# Altium schematic sheet Microcontroleur.SchDoc
size A3; PageSetup: Record=PageOptions|CenterHorizontal=True|CenterVertical=True|PrintScale=0.24|XCorrection=1.00|YCorrection=1.00|PrintKind=0|BorderSize=5000000|LeftOffset=0|BottomOffset=0|Orientation=2|PaperLength=1000|PaperWidth=1000|Scale=100|PaperSource=7|PrintQuality=-4|MediaType=1|DitherType=10|PaperKind=A4|PrintScaleMode=1; Organization: Altium Limited; Address1: Laboratoire de Systèmes Embarqués; Address2: 7, rue de la Serre; Address3: 2610 Saint-Imier / Switzerland
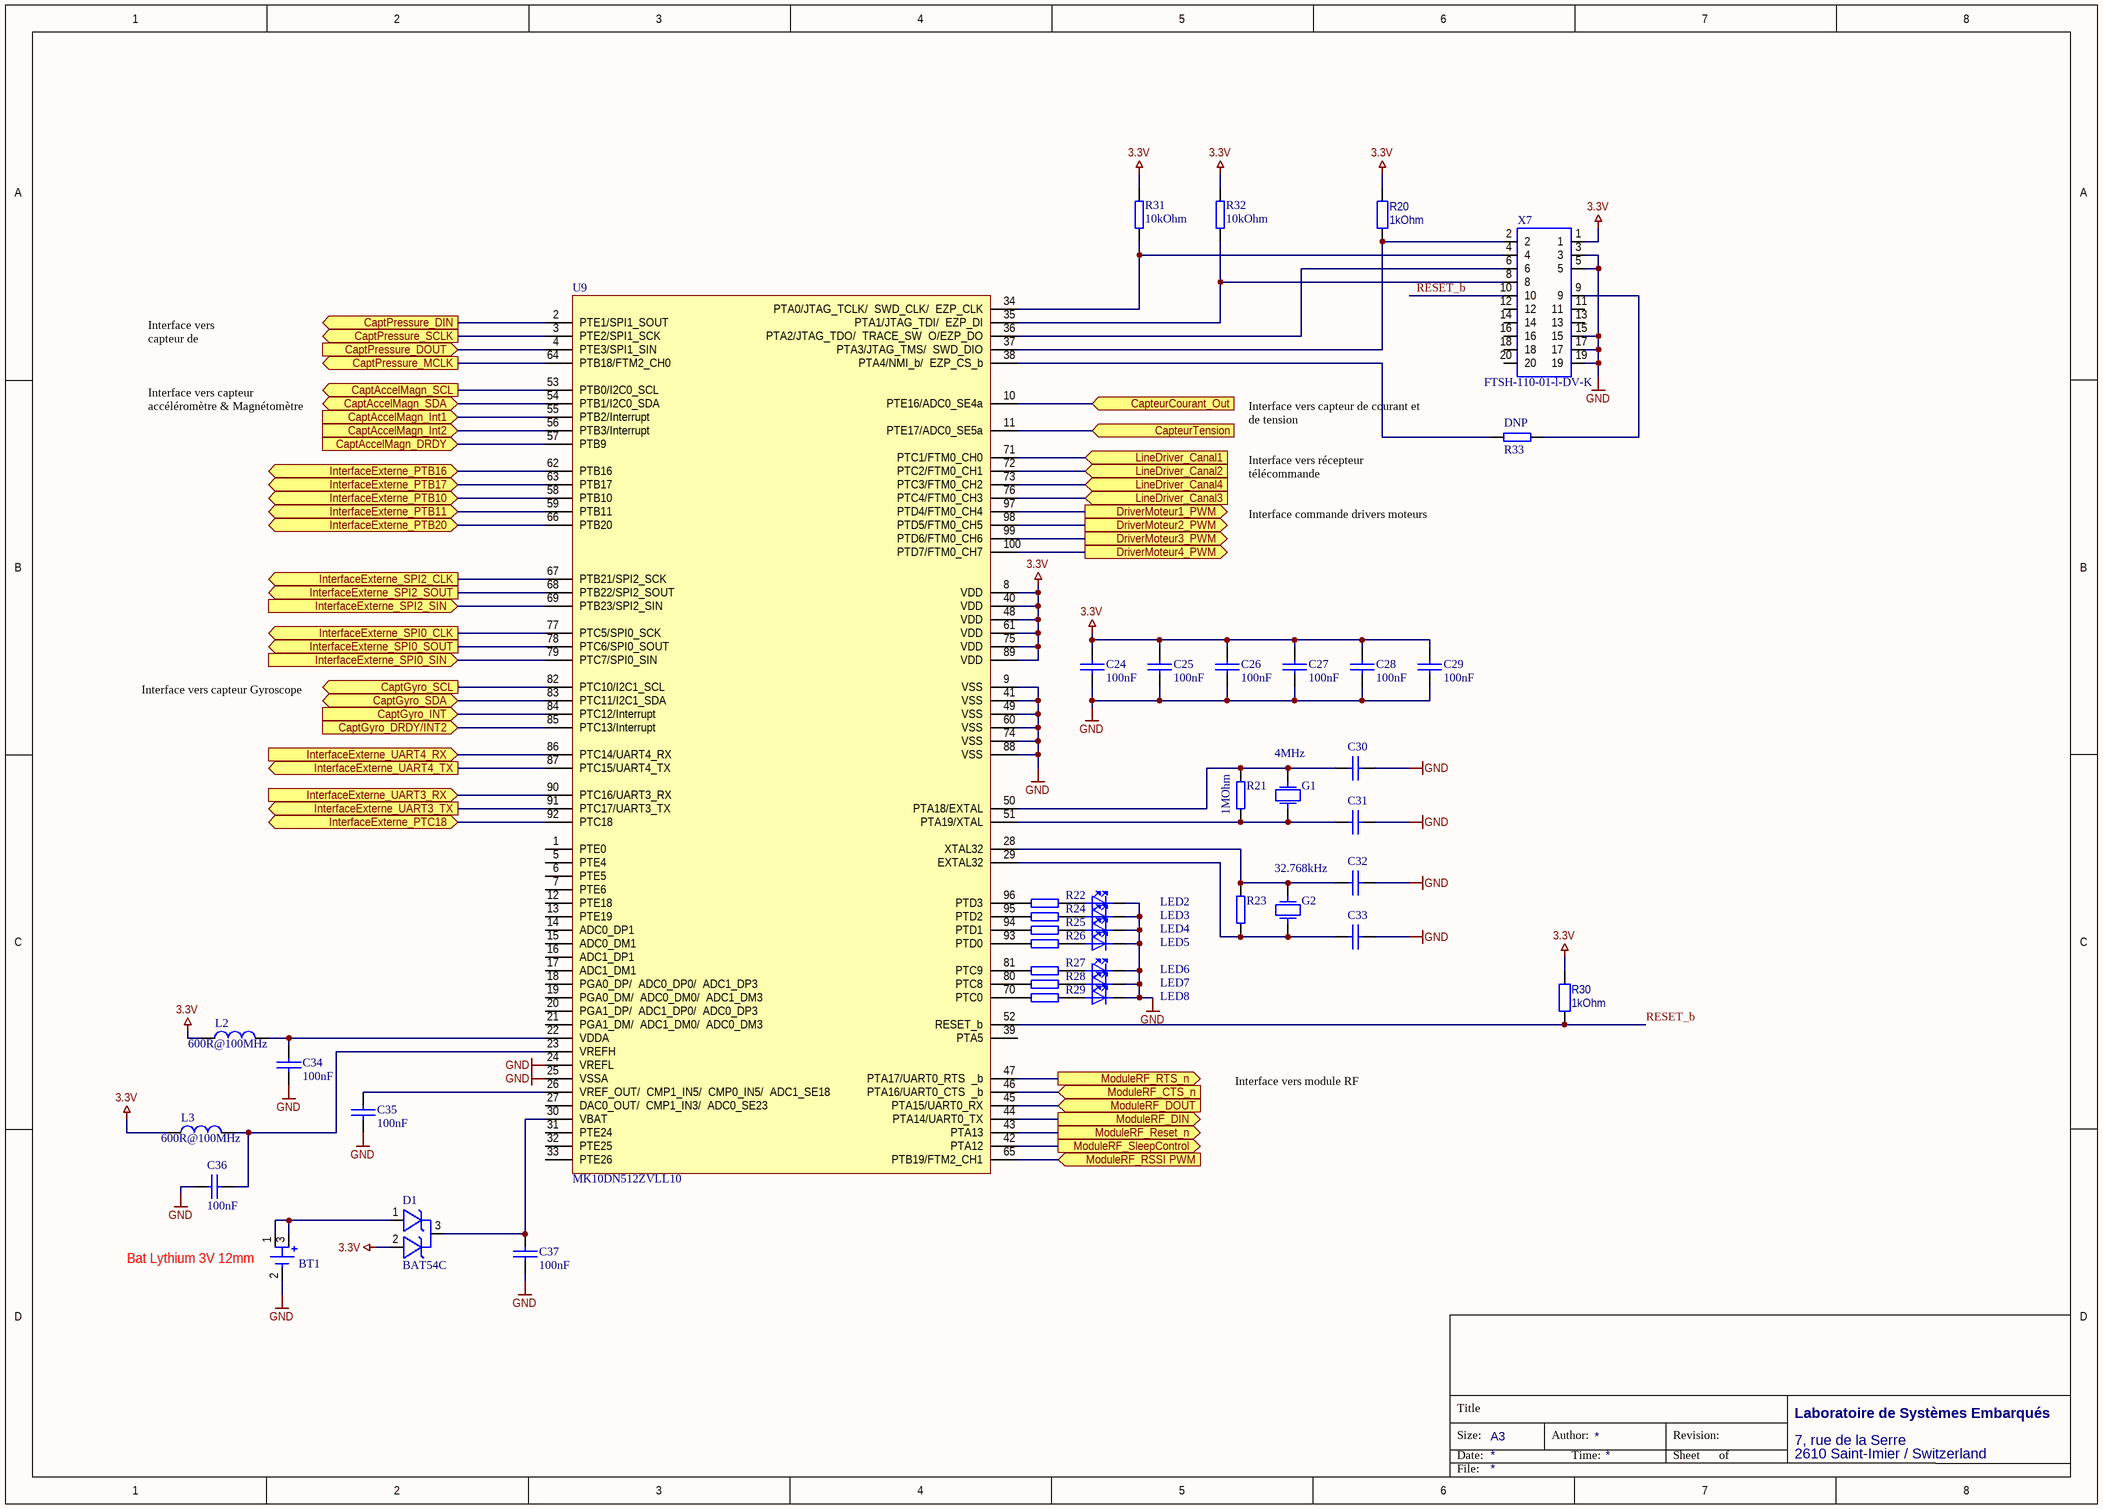
[diagram p0: Microcontroleur.SchDoc]

## Parts
BT1  3000TR  [3000TR]  (value not drawn)
C24  value 100nF  [060301]  (hidden comment: GRM188R71E104KA01D)
C25  value 100nF  [060301]  (hidden comment: GRM188R71E104KA01D)
C26  value 100nF  [060301]  (hidden comment: GRM188R71E104KA01D)
C27  value 100nF  [060301]  (hidden comment: GRM188R71E104KA01D)
C28  value 100nF  [060301]  (hidden comment: GRM188R71E104KA01D)
C29  value 100nF  [060301]  (hidden comment: GRM188R71E104KA01D)
C30  GQM2195C1H200JB01D  [060301]  (value not drawn)
C31  GQM2195C1H200JB01D  [080501]  (value not drawn)
C32  GRM21A5C2E120JW01D  [080501]  (value not drawn)
C33  GRM21A5C2E120JW01D  [080501]  (value not drawn)
C34  value 100nF  [060301]  (hidden comment: GRM188R71E104KA01D)
C35  value 100nF  [060301]  (hidden comment: GRM188R71E104KA01D)
C36  value 100nF  [060301]  (hidden comment: GRM188R71E104KA01D)
C37  value 100nF  [060301]  (hidden comment: GRM188R71E104KA01D)
D1  BAT54C  [SOT2301]
G1  value 4MHz  [Crystal]  (hidden comment: ECS-40-20-5PX-TR)
G2  value 32.768kHz  [Crystal2]  (hidden comment: ECS-.327-12.5-38)
L2  value 600R@100MHz  [080501]  (hidden comment: BLM21AG601SN1D)
L3  value 600R@100MHz  [080501]  (hidden comment: BLM21AG601SN1D)
LED2  LG L29K-G2J1-24-Z  [060301_led]  (value not drawn)
LED3  LG L29K-G2J1-24-Z  [060301_led]  (value not drawn)
LED4  LG L29K-G2J1-24-Z  [060301_led]  (value not drawn)
LED5  LG L29K-G2J1-24-Z  [060301_led]  (value not drawn)
LED6  LG L29K-G2J1-24-Z  [060301_led]  (value not drawn)
LED7  LG L29K-G2J1-24-Z  [060301_led]  (value not drawn)
LED8  LG L29K-G2J1-24-Z  [060301_led]  (value not drawn)
R20  value 1kOhm  [060301]  (hidden comment: RC0603FR-071KL)
R21  value 1MOhm  [080501]  (hidden comment: RMCF0805JT820R)
R22  RMCF0805JT820R  [080501]  (value not drawn)
R23  ERJ-6GEYJ103V  [080501]  (value not drawn)
R24  RMCF0805JT820R  [080501]  (value not drawn)
R25  RMCF0805JT820R  [080501]  (value not drawn)
R26  RMCF0805JT820R  [080501]  (value not drawn)
R27  RMCF0805JT820R  [080501]  (value not drawn)
R28  RMCF0805JT820R  [080501]  (value not drawn)
R29  RMCF0805JT820R  [080501]  (value not drawn)
R30  value 1kOhm  [060301]  (hidden comment: RC0603FR-071KL)
R31  value 10kOhm  [080501]  (hidden comment: ERJ-6GEYJ103V)
R32  value 10kOhm  [080501]  (hidden comment: ERJ-6GEYJ103V)
R33  value DNP  [080501]  (hidden comment: RMCF0805JT820R)
U9  MK10DN512ZVLL10  [QFP100-1]
X7  FTSH-110-01-l-DV-K  [FTSH-110-01-X-DV-EJ]

## Ports
CaptAccelMagn_DRDY (in), CaptAccelMagn_Int1 (in), CaptAccelMagn_Int2 (in), CaptAccelMagn_SCL (out), CaptAccelMagn_SDA (bidir), CapteurCourant_Out (in), CapteurTension (in), CaptGyro_DRDY/INT2 (in), CaptGyro_INT (in), CaptGyro_SCL (out), CaptGyro_SDA (bidir), CaptPressure_DIN (out), CaptPressure_DOUT (in), CaptPressure_MCLK (out), CaptPressure_SCLK (out), DriverMoteur1_PWM (out), DriverMoteur2_PWM (out), DriverMoteur3_PWM (out), DriverMoteur4_PWM (out), InterfaceExterne_PTB10 (bidir), InterfaceExterne_PTB11 (bidir), InterfaceExterne_PTB16 (bidir), InterfaceExterne_PTB17 (bidir), InterfaceExterne_PTB20 (bidir), InterfaceExterne_PTC18 (bidir), InterfaceExterne_SPI0_CLK (out), InterfaceExterne_SPI0_SIN (in), InterfaceExterne_SPI0_SOUT (out), InterfaceExterne_SPI2_CLK (out), InterfaceExterne_SPI2_SIN (in), InterfaceExterne_SPI2_SOUT (out), InterfaceExterne_UART3_RX (in), InterfaceExterne_UART3_TX (out), InterfaceExterne_UART4_RX (in), InterfaceExterne_UART4_TX (out), LineDriver_Canal1 (in), LineDriver_Canal2 (in), LineDriver_Canal3 (in), LineDriver_Canal4 (in), ModuleRF_CTS_n (in), ModuleRF_DIN (out), ModuleRF_DOUT (in), ModuleRF_Reset_n (out), ModuleRF_RSSI PWM (in), ModuleRF_RTS_n (out), ModuleRF_SleepControl (out)

## Nets
3.3V: C24.1 C25.1 C26.1 C27.1 C28.1 C29.1 D1.2(C2) L2.1 L3.1 R20.1 R30.1 R31.2 R32.2 U9.8(VDD) U9.40(VDD) U9.48(VDD) U9.61(VDD) U9.75(VDD) U9.89(VDD) X7.1
GND: BT1.2(C) C24.2 C25.2 C26.2 C27.2 C28.2 C29.2 C30.2 C31.2 C32.2 C33.2 C34.2 C35.1 C36.1 C37.1 LED2.2(CATHODE) LED3.2(CATHODE) LED4.2(CATHODE) LED5.2(CATHODE) LED6.2(CATHODE) LED7.2(CATHODE) LED8.2(CATHODE) U9.9(VSS) U9.24(VREFL) U9.25(VSSA) U9.41(VSS) U9.49(VSS) U9.60(VSS) U9.74(VSS) U9.88(VSS) X7.3 X7.5 X7.15 X7.17 X7.19
CaptAccelMagn_DRDY: U9.57(PTB9) ; port CaptAccelMagn_DRDY
CaptAccelMagn_Int1: U9.55(PTB2/Interrupt) ; port CaptAccelMagn_Int1
CaptAccelMagn_Int2: U9.56(PTB3/Interrupt) ; port CaptAccelMagn_Int2
CaptAccelMagn_SCL: U9.53(PTB0/I2C0_SCL) ; port CaptAccelMagn_SCL
CaptAccelMagn_SDA: U9.54(PTB1/I2C0_SDA) ; port CaptAccelMagn_SDA
CapteurCourant_Out: U9.10(PTE16/ADC0_SE4a) ; port CapteurCourant_Out
CapteurTension: U9.11(PTE17/ADC0_SE5a) ; port CapteurTension
CaptGyro_DRDY/INT2: U9.85(PTC13/Interrupt) ; port CaptGyro_DRDY/INT2
CaptGyro_INT: U9.84(PTC12/Interrupt) ; port CaptGyro_INT
CaptGyro_SCL: U9.82(PTC10/I2C1_SCL) ; port CaptGyro_SCL
CaptGyro_SDA: U9.83(PTC11/I2C1_SDA) ; port CaptGyro_SDA
CaptPressure_DIN: U9.2(PTE1/SPI1_SOUT) ; port CaptPressure_DIN
CaptPressure_DOUT: U9.4(PTE3/SPI1_SIN) ; port CaptPressure_DOUT
CaptPressure_MCLK: U9.64(PTB18/FTM2_CH0) ; port CaptPressure_MCLK
CaptPressure_SCLK: U9.3(PTE2/SPI1_SCK) ; port CaptPressure_SCLK
DriverMoteur1_PWM: U9.97(PTD4/FTM0_CH4) ; port DriverMoteur1_PWM
DriverMoteur2_PWM: U9.98(PTD5/FTM0_CH5) ; port DriverMoteur2_PWM
DriverMoteur3_PWM: U9.99(PTD6/FTM0_CH6) ; port DriverMoteur3_PWM
DriverMoteur4_PWM: U9.100(PTD7/FTM0_CH7) ; port DriverMoteur4_PWM
InterfaceExterne_PTB10: U9.58(PTB10) ; port InterfaceExterne_PTB10
InterfaceExterne_PTB11: U9.59(PTB11) ; port InterfaceExterne_PTB11
InterfaceExterne_PTB16: U9.62(PTB16) ; port InterfaceExterne_PTB16
InterfaceExterne_PTB17: U9.63(PTB17) ; port InterfaceExterne_PTB17
InterfaceExterne_PTB20: U9.66(PTB20) ; port InterfaceExterne_PTB20
InterfaceExterne_PTC18: U9.92(PTC18) ; port InterfaceExterne_PTC18
InterfaceExterne_SPI0_CLK: U9.77(PTC5/SPI0_SCK) ; port InterfaceExterne_SPI0_CLK
InterfaceExterne_SPI0_SIN: U9.79(PTC7/SPI0_SIN) ; port InterfaceExterne_SPI0_SIN
InterfaceExterne_SPI0_SOUT: U9.78(PTC6/SPI0_SOUT) ; port InterfaceExterne_SPI0_SOUT
InterfaceExterne_SPI2_CLK: U9.67(PTB21/SPI2_SCK) ; port InterfaceExterne_SPI2_CLK
InterfaceExterne_SPI2_SIN: U9.69(PTB23/SPI2_SIN) ; port InterfaceExterne_SPI2_SIN
InterfaceExterne_SPI2_SOUT: U9.68(PTB22/SPI2_SOUT) ; port InterfaceExterne_SPI2_SOUT
InterfaceExterne_UART3_RX: U9.90(PTC16/UART3_RX) ; port InterfaceExterne_UART3_RX
InterfaceExterne_UART3_TX: U9.91(PTC17/UART3_TX) ; port InterfaceExterne_UART3_TX
InterfaceExterne_UART4_RX: U9.86(PTC14/UART4_RX) ; port InterfaceExterne_UART4_RX
InterfaceExterne_UART4_TX: U9.87(PTC15/UART4_TX) ; port InterfaceExterne_UART4_TX
LineDriver_Canal1: U9.71(PTC1/FTM0_CH0) ; port LineDriver_Canal1
LineDriver_Canal2: U9.72(PTC2/FTM0_CH1) ; port LineDriver_Canal2
LineDriver_Canal3: U9.76(PTC4/FTM0_CH3) ; port LineDriver_Canal3
LineDriver_Canal4: U9.73(PTC3/FTM0_CH2) ; port LineDriver_Canal4
ModuleRF_CTS_n: U9.46(PTA16/UART0_CTS___b) ; port ModuleRF_CTS_n
ModuleRF_DIN: U9.44(PTA14/UART0_TX) ; port ModuleRF_DIN
ModuleRF_DOUT: U9.45(PTA15/UART0_RX) ; port ModuleRF_DOUT
ModuleRF_Reset_n: U9.43(PTA13) ; port ModuleRF_Reset_n
ModuleRF_RSSI PWM: U9.65(PTB19/FTM2_CH1) ; port ModuleRF_RSSI PWM
ModuleRF_RTS_n: U9.47(PTA17/UART0_RTS___b) ; port ModuleRF_RTS_n
ModuleRF_SleepControl: U9.42(PTA12) ; port ModuleRF_SleepControl
RESET_b: R30.2 U9.52(RESET_b) X7.10
NetBT1_1: BT1.1(A1) BT1.3(A2) D1.1(C1)
NetC30_1: C30.1 G1.1 R21.2 U9.50(PTA18/EXTAL)
NetC31_1: C31.1 G1.2 R21.1 U9.51(PTA19/XTAL)
NetC32_1: C32.1 G2.2 R23.2 U9.28(XTAL32)
NetC33_1: C33.1 G2.1 R23.1 U9.29(EXTAL32)
NetC34_1: C34.1 L2.2 U9.22(VDDA)
NetC35_2: C35.2 U9.26(VREF_OUT/__CMP1_IN5/__CMP0_IN5/__ADC1_SE18)
NetC36_2: C36.2 L3.2 U9.23(VREFH)
NetC37_2: C37.2 D1.3(Anode) U9.30(VBAT)
NetLED2_1: LED2.1(ANODE) R24.2
NetLED3_1: LED3.1(ANODE) R22.2
NetLED4_1: LED4.1(ANODE) R25.2
NetLED5_1: LED5.1(ANODE) R26.2
NetLED6_1: LED6.1(ANODE) R27.2
NetLED7_1: LED7.1(ANODE) R28.2
NetLED8_1: LED8.1(ANODE) R29.2
NetR20_2: R20.2 U9.37(PTA3/JTAG_TMS/__SWD_DIO) X7.2
NetR22_1: R22.1 U9.96(PTD3)
NetR24_1: R24.1 U9.95(PTD2)
NetR25_1: R25.1 U9.94(PTD1)
NetR26_1: R26.1 U9.93(PTD0)
NetR27_1: R27.1 U9.81(PTC9)
NetR28_1: R28.1 U9.80(PTC8)
NetR29_1: R29.1 U9.70(PTC0)
NetR31_1: R31.1 U9.34(PTA0/JTAG_TCLK/__SWD_CLK/__EZP_CLK) X7.4
NetR32_1: R32.1 U9.35(PTA1/JTAG_TDI/__EZP_DI) X7.8
NetR33_1: R33.1 X7.9
NetR33_2: R33.2 U9.38(PTA4/NMI_b/__EZP_CS_b)
NetU9_36: U9.36(PTA2/JTAG_TDO/__TRACE_SW__O/EZP_DO) X7.6

Not connected (* = marked no-connect by the designer): U9 1(PTE0) 5(PTE4) 6(PTE5) 7(PTE6) 12(PTE18) 13(PTE19) 14(ADC0_DP1) 15(ADC0_DM1) 16(ADC1_DP1) 17(ADC1_DM1) 18(PGA0_DP/__ADC0_DP0/__ADC1_DP3) 19(PGA0_DM/__ADC0_DM0/__ADC1_DM3) 20(PGA1_DP/__ADC1_DP0/__ADC0_DP3) 21(PGA1_DM/__ADC1_DM0/__ADC0_DM3) 27(DAC0_OUT/__CMP1_IN3/__ADC0_SE23) 31(PTE24) 32(PTE25) 33(PTE26) 39(PTA5); X7 11 12 13 14 16 18 20

## Notes on the sheet
- Interface vers capteur de pression
- Interface vers capteur accéléromètre & Magnétomètre
- Interface vers capteur de courant et de tension
- Interface vers récepteur télécommande
- Interface commande drivers moteurs
- Interface vers capteur Gyroscope
- Interface vers module RF
- (near BT1) Bat Lythium 3V 12mm
- Title
- Size:
- Date:
- A3
- Author:
- Time:
- Revision:
- Sheet
- of
- File:

## Library data of the parts
BT1 = BAT_1: HOLDER BATTERY COIN 12MM DIA SMD; Manufacturer: Keystone Electronics; EtatCommande: Commandé; Supplier 1: Digi-Key; Supplier Part Number 1: 3000KTR-ND; Part Name: 3000TR
C24-C29 C34-C37 = CAPA: EtatCommande: Interne; Text Field1: CAPA; Supplier 1: Digi-Key; Supplier Part Number 1: 490-1524-1-ND
C30 C31 = CAPA: Value: 20pF; EtatCommande: Interne; Text Field1: CAPA; Supplier 1: Digi-Key; Supplier Part Number 1: 490-3607-1-ND
C32 C33 = CAPA: Value: 12pF; EtatCommande: Interne; Text Field1: CAPA; Supplier 1: Digi-Key; Supplier Part Number 1: 490-5531-1-ND
D1 = BAT54C: DIODE SCHTTKY CC 200MA 30V SOT23; Manufacturer: Comchip Technology; Part Name: BAT54C-G; EtatCommande: Commandé; Supplier 1: Digi-Key; Supplier Part Number 1: 641-1320-1-ND
G1 = CRYSTAL: EtatCommande: Commandé; Text Field1: CRYSTAL; Supplier 1: Digi-Key; Supplier Part Number 1: XC1238CT-ND
G2 = CRYSTAL: EtatCommande: Interne; Text Field1: CRYSTAL; Supplier 1: Digi-Key; Supplier Part Number 1: XC1616CT-ND
L2 L3 = Ferrite Bead: FERRITE CHIP 600 OHM 200MA 0805; Manufacturer: Murata Electronics; EtatCommande: Commandé; Part Name: BLM21AG601SN1D; Supplier 1: Digi-Key; Supplier Part Number 1: 490-1040-6-ND
LED2-LED8 = LED: EtatCommande: Commandé; Supplier 1: Digi-Key; Supplier Part Number 1: 475-2709-1-ND; Text Field1: LED
R20 R30 = RES: RES 1.00K OHM 1/10W 1% 0603 SMD; Manufacturer: Yageo; EtatCommande: Interne; Text Field1: RESISTANCE; Part Name: RC0603FR-071KL; Supplier 1: Digi-Key; Supplier Part Number 1: 311-1.00KHRCT-ND
R21 R31-R33 = RES: Text Field1: RESISTANCE; EtatCommande: Interne
  R21: Supplier 1: Digi-Key; Supplier Part Number 1: RMCF0805JT820RDKR-ND
  R31 R32: Supplier 1: Digi-Key; Supplier Part Number 1: P10KACT-ND
R22 R24-R29 = RES: Text Field1: RESISTANCE; Value: 820Ohm; EtatCommande: Interne; Supplier 1: Digi-Key; Supplier Part Number 1: RMCF0805JT820RDKR-ND
R23 = RES: Text Field1: RESISTANCE; Value: 10kOhm; EtatCommande: Interne; Supplier 1: Digi-Key; Supplier Part Number 1: P10KADKR-ND
X7 = CON20_JTAG: CONN UNSHROUDED HDR 20POS .05"; Manufacturer: Samtec Inc; Part Name: FTSH-110-01-L-DV-K-P-TR; Supplier 1: Samtec Inc; Supplier Part Number 1: FTSH-110-01-L-DV-K-P-TR